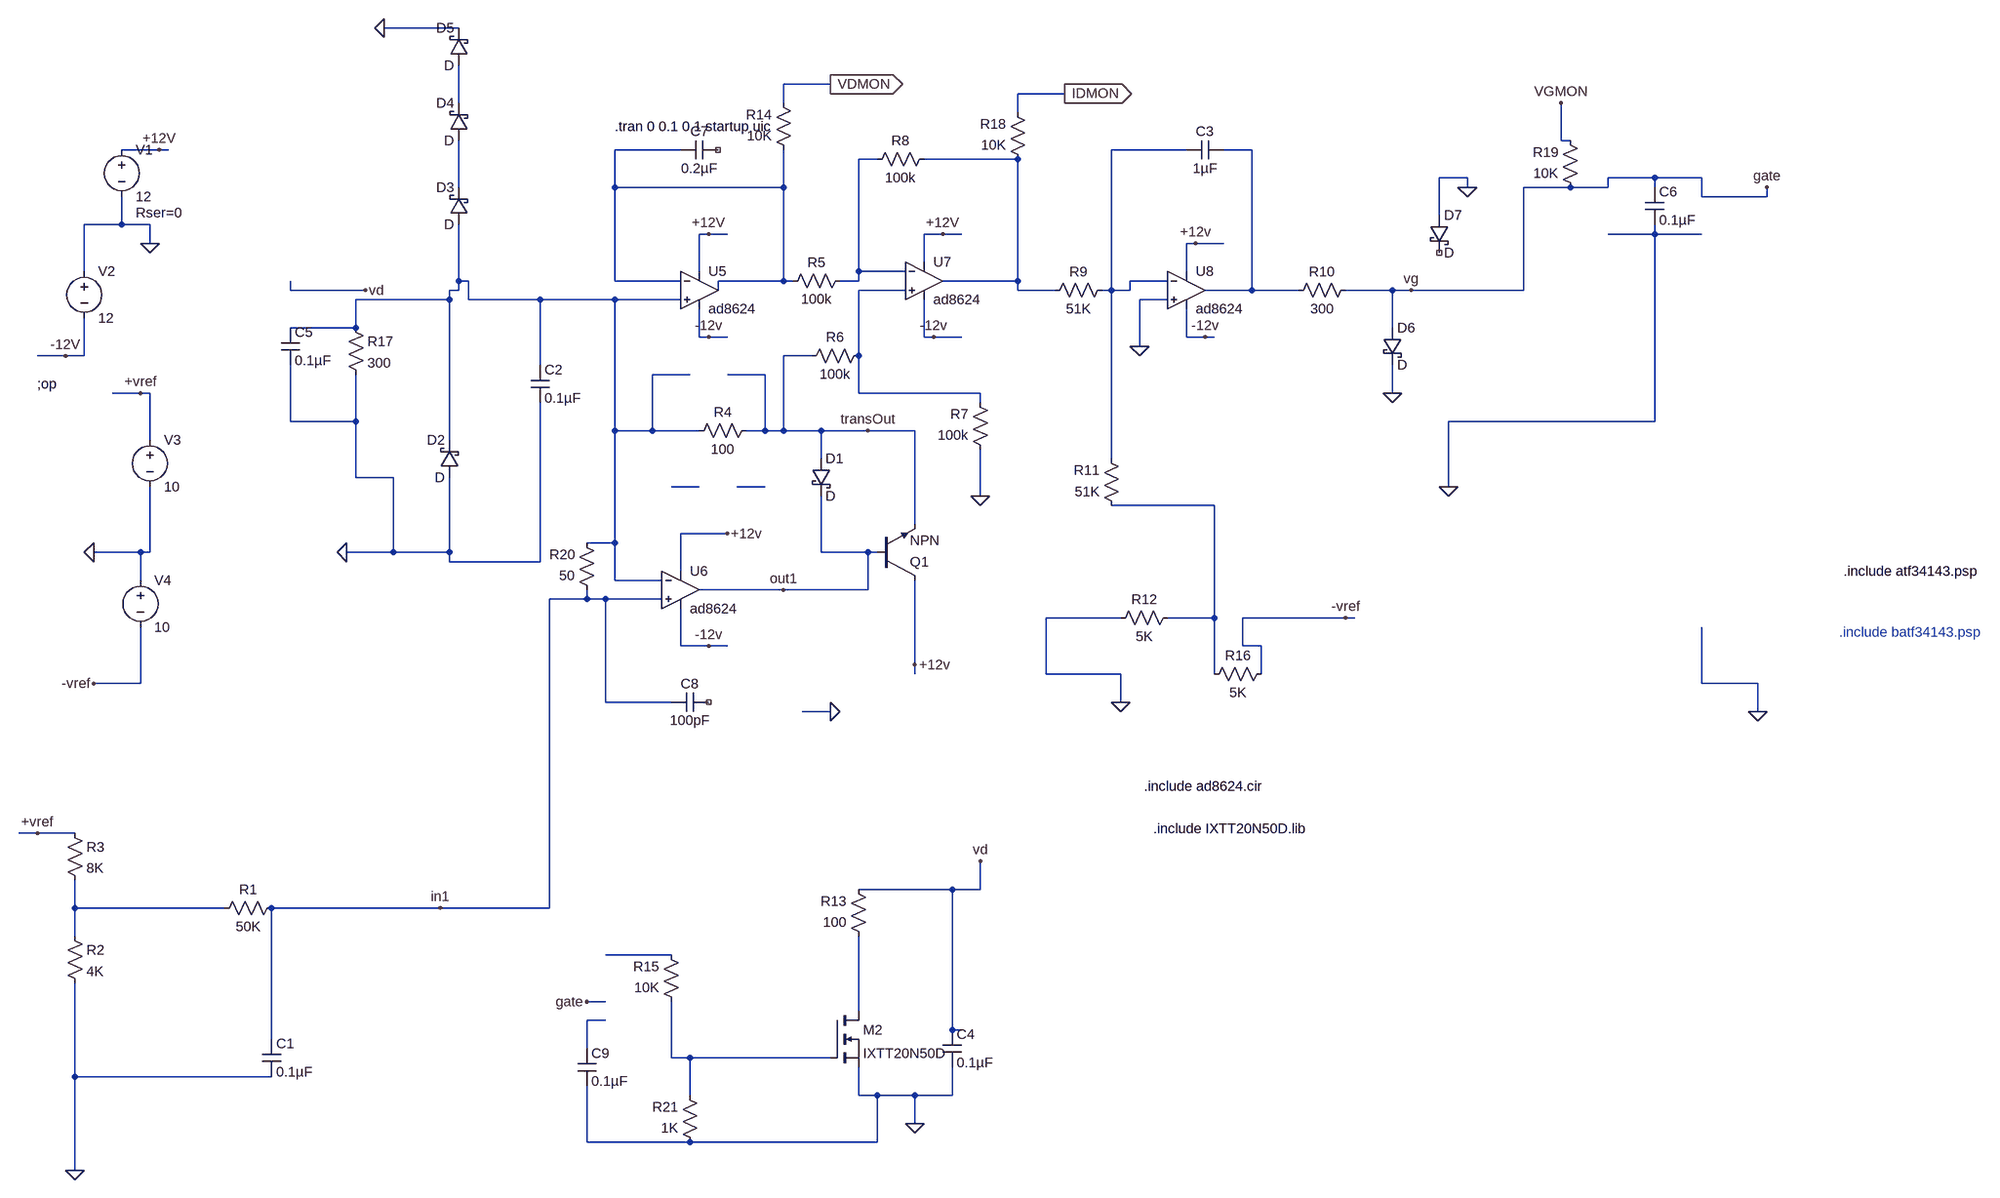
[diagram p0: schematic lnaPSUSpice.asc]
lnaPSUSpice.asc, the LTspice schematic file:
Version 4
SHEET 1 3948 1396
WIRE 160 -576 32 -576
WIRE 848 -480 768 -480
WIRE 1248 -464 1168 -464
WIRE 160 -448 160 -512
WIRE 768 -448 768 -480
WIRE 1168 -432 1168 -464
WIRE 2096 -384 2096 -448
WIRE 2112 -384 2096 -384
WIRE -352 -368 -416 -368
WIRE -336 -368 -352 -368
WIRE 592 -368 480 -368
WIRE 1456 -368 1328 -368
WIRE 1568 -368 1520 -368
WIRE 928 -352 896 -352
WIRE 1168 -352 1008 -352
WIRE 1936 -320 1888 -320
WIRE 2256 -320 2176 -320
WIRE 2336 -320 2256 -320
WIRE 160 -304 160 -384
WIRE 480 -304 480 -368
WIRE 768 -304 768 -368
WIRE 768 -304 480 -304
WIRE 1936 -304 1936 -320
WIRE 2112 -304 2032 -304
WIRE 2176 -304 2176 -320
WIRE 2176 -304 2112 -304
WIRE 2256 -304 2256 -320
WIRE 2336 -288 2336 -320
WIRE 2448 -288 2448 -304
WIRE 2448 -288 2336 -288
WIRE 1888 -256 1888 -320
WIRE -416 -240 -416 -288
WIRE -416 -240 -480 -240
WIRE -368 -240 -416 -240
WIRE 640 -224 624 -224
WIRE 672 -224 640 -224
WIRE 1040 -224 1008 -224
WIRE 1072 -224 1040 -224
WIRE 2256 -224 2256 -240
WIRE 2256 -224 2176 -224
WIRE 2336 -224 2256 -224
WIRE -368 -208 -368 -240
WIRE 1472 -208 1456 -208
WIRE 1520 -208 1472 -208
WIRE 1008 -176 1008 -224
WIRE -480 -160 -480 -240
WIRE 624 -160 624 -224
WIRE 896 -160 896 -352
WIRE 976 -160 896 -160
WIRE 1456 -160 1456 -208
WIRE 160 -144 160 -240
WIRE 176 -144 160 -144
WIRE 480 -144 480 -304
WIRE 592 -144 480 -144
WIRE 768 -144 768 -304
WIRE 768 -144 656 -144
WIRE 784 -144 768 -144
WIRE 896 -144 896 -160
WIRE 896 -144 864 -144
WIRE 1168 -144 1168 -352
WIRE 1168 -144 1040 -144
WIRE 1424 -144 1360 -144
WIRE -128 -128 -128 -144
WIRE 0 -128 -128 -128
WIRE 160 -128 160 -144
WIRE 160 -128 144 -128
WIRE 656 -128 656 -144
WIRE 976 -128 896 -128
WIRE 1168 -128 1168 -144
WIRE 1232 -128 1168 -128
WIRE 1328 -128 1328 -368
WIRE 1328 -128 1312 -128
WIRE 1360 -128 1360 -144
WIRE 1360 -128 1328 -128
WIRE 1568 -128 1568 -368
WIRE 1568 -128 1488 -128
WIRE 1648 -128 1568 -128
WIRE 1808 -128 1728 -128
WIRE 1840 -128 1808 -128
WIRE 2032 -128 2032 -304
WIRE 2032 -128 1840 -128
WIRE 144 -112 144 -128
WIRE 144 -112 -16 -112
WIRE 176 -112 176 -144
WIRE 352 -112 176 -112
WIRE 480 -112 352 -112
WIRE 592 -112 480 -112
WIRE 1424 -112 1376 -112
WIRE -16 -64 -16 -112
WIRE -16 -64 -128 -64
WIRE 1808 -64 1808 -128
WIRE 624 -48 624 -96
WIRE 640 -48 624 -48
WIRE 672 -48 640 -48
WIRE 1008 -48 1008 -112
WIRE 1024 -48 1008 -48
WIRE 1072 -48 1024 -48
WIRE 1456 -48 1456 -96
WIRE 1488 -48 1456 -48
WIRE 1504 -48 1488 -48
WIRE 1376 -32 1376 -112
WIRE -512 -16 -560 -16
WIRE -480 -16 -480 -80
WIRE -480 -16 -512 -16
WIRE 816 -16 768 -16
WIRE 896 -16 896 -128
WIRE 352 0 352 -112
WIRE 608 16 544 16
WIRE 736 16 672 16
WIRE -384 48 -432 48
WIRE -368 48 -384 48
WIRE 896 48 896 -16
WIRE 1104 48 896 48
WIRE 1808 48 1808 0
WIRE 1104 64 1104 48
WIRE -128 96 -128 0
WIRE -16 96 -16 16
WIRE -16 96 -128 96
WIRE 2256 96 2256 -224
WIRE 2256 96 1904 96
WIRE 480 112 480 -112
WIRE 544 112 544 16
WIRE 544 112 480 112
WIRE 624 112 544 112
WIRE 736 112 736 16
WIRE 736 112 704 112
WIRE 768 112 768 -16
WIRE 768 112 736 112
WIRE 832 112 768 112
WIRE 912 112 832 112
WIRE 992 112 912 112
WIRE -368 128 -368 48
WIRE 144 128 144 -112
WIRE 832 160 832 112
WIRE 1328 160 1328 -128
WIRE -16 192 -16 96
WIRE 48 192 -16 192
WIRE 624 208 576 208
WIRE 736 208 688 208
WIRE 1904 208 1904 96
WIRE 1104 224 1104 144
WIRE 1504 240 1328 240
WIRE 992 272 992 112
WIRE 672 288 592 288
WIRE 480 304 480 112
WIRE 480 304 432 304
WIRE -384 320 -464 320
WIRE -368 320 -368 208
WIRE -368 320 -384 320
WIRE 48 320 48 192
WIRE 48 320 -32 320
WIRE 144 320 144 192
WIRE 144 320 48 320
WIRE 832 320 832 224
WIRE 912 320 832 320
WIRE 928 320 912 320
WIRE 144 336 144 320
WIRE 352 336 352 64
WIRE 352 336 144 336
WIRE 592 352 592 288
WIRE -384 368 -384 320
WIRE 480 368 480 304
WIRE 560 368 480 368
WIRE 768 384 624 384
WIRE 912 384 912 320
WIRE 912 384 768 384
WIRE 432 400 432 384
WIRE 432 400 368 400
WIRE 464 400 432 400
WIRE 560 400 464 400
WIRE 1344 432 1216 432
WIRE 1504 432 1504 240
WIRE 1504 432 1424 432
WIRE 1728 432 1552 432
WIRE 1744 432 1728 432
WIRE 592 480 592 416
WIRE 640 480 592 480
WIRE 672 480 640 480
WIRE 1552 480 1552 432
WIRE 1584 480 1552 480
WIRE 992 512 992 368
WIRE 992 528 992 512
WIRE 1216 528 1216 432
WIRE 1344 528 1216 528
WIRE 1504 528 1504 432
WIRE 1584 528 1584 480
WIRE -384 544 -384 448
WIRE -384 544 -464 544
WIRE 2336 544 2336 448
WIRE 2432 544 2336 544
WIRE 464 576 464 400
WIRE 576 576 464 576
WIRE 1344 576 1344 528
WIRE 848 592 800 592
WIRE 2432 592 2432 544
WIRE -560 800 -592 800
WIRE -496 800 -560 800
WIRE 1056 896 896 896
WIRE 1104 896 1104 848
WIRE 1104 896 1056 896
WIRE -496 928 -496 880
WIRE -240 928 -496 928
WIRE 128 928 -160 928
WIRE 368 928 368 400
WIRE 368 928 128 928
WIRE -496 976 -496 928
WIRE 576 1008 464 1008
WIRE 464 1088 432 1088
WIRE 896 1104 896 976
WIRE 464 1120 432 1120
WIRE 1056 1136 1056 896
WIRE 1072 1136 1056 1136
WIRE -160 1152 -160 928
WIRE 432 1168 432 1120
WIRE 576 1184 576 1088
WIRE 608 1184 576 1184
WIRE 848 1184 608 1184
WIRE -496 1216 -496 1056
WIRE -160 1216 -496 1216
WIRE 608 1248 608 1184
WIRE 896 1248 896 1200
WIRE 928 1248 896 1248
WIRE 992 1248 928 1248
WIRE 1056 1248 1056 1200
WIRE 1056 1248 992 1248
WIRE 992 1296 992 1248
WIRE 432 1328 432 1232
WIRE 608 1328 432 1328
WIRE 928 1328 928 1248
WIRE 928 1328 608 1328
WIRE -496 1376 -496 1216
FLAG -368 -208 0
FLAG -352 -368 +12V
FLAG -512 -16 -12V
FLAG 640 -224 +12V
FLAG 1040 -224 +12V
FLAG 640 -48 -12v
FLAG 1024 -48 -12v
FLAG 1488 -48 -12v
FLAG 1472 -208 +12v
FLAG -384 48 +vref
FLAG -464 544 -vref
FLAG -464 320 0
FLAG -496 1376 0
FLAG 672 288 +12v
FLAG 640 480 -12v
FLAG 992 512 +12v
FLAG -560 800 +vref
FLAG -32 320 0
FLAG 1104 224 0
FLAG 1376 -32 0
FLAG 1728 432 -vref
FLAG 1840 -128 vg
FLAG 0 -128 vd
FLAG 1904 208 0
FLAG 128 928 in1
FLAG 768 384 out1
FLAG 32 -576 0
FLAG 1344 576 0
FLAG 1808 48 0
FLAG 1936 -304 0
FLAG 912 112 transOut
FLAG 848 -480 VDMON
IOPIN 848 -480 Out
FLAG 1248 -464 IDMON
IOPIN 1248 -464 Out
FLAG 2096 -448 VGMON
FLAG 2432 592 0
FLAG 992 1296 0
FLAG 2448 -304 gate
FLAG 432 1088 gate
FLAG 1104 848 vd
FLAG 848 592 0
SYMBOL voltage -416 -384 R0
WINDOW 123 0 0 Left 2
WINDOW 39 24 124 Left 2
SYMATTR SpiceLine Rser=0
SYMATTR InstName V1
SYMATTR Value 12
SYMBOL voltage -480 -176 R0
WINDOW 123 0 0 Left 2
WINDOW 39 0 0 Left 2
SYMATTR InstName V2
SYMATTR Value 12
SYMBOL res -144 912 R90
WINDOW 0 0 56 VBottom 2
WINDOW 3 32 56 VTop 2
SYMATTR InstName R1
SYMATTR Value 50K
SYMBOL res -512 960 R0
SYMATTR InstName R2
SYMATTR Value 4K
SYMBOL res -512 784 R0
SYMATTR InstName R3
SYMATTR Value 8K
SYMBOL voltage -368 112 R0
WINDOW 123 0 0 Left 2
WINDOW 39 0 0 Left 2
SYMATTR InstName V3
SYMATTR Value 10
SYMBOL voltage -384 352 R0
WINDOW 123 0 0 Left 2
WINDOW 39 0 0 Left 2
SYMATTR InstName V4
SYMATTR Value 10
SYMBOL cap -176 1152 R0
SYMATTR InstName C1
SYMATTR Value 0.1µF
SYMBOL res 720 96 R90
WINDOW 0 0 56 VBottom 2
WINDOW 3 32 56 VTop 2
SYMATTR InstName R4
SYMATTR Value 100
SYMBOL npn 928 368 M180
SYMATTR InstName Q1
SYMBOL schottky 816 160 R0
SYMATTR InstName D1
SYMBOL schottky 160 192 R180
WINDOW 0 24 64 Left 2
WINDOW 3 24 0 Left 2
SYMATTR InstName D2
SYMBOL cap 336 0 R0
SYMATTR InstName C2
SYMATTR Value 0.1µF
SYMBOL res 880 -160 R90
WINDOW 0 0 56 VBottom 2
WINDOW 3 32 56 VTop 2
SYMATTR InstName R5
SYMATTR Value 100k
SYMBOL res 912 -32 R90
WINDOW 0 0 56 VBottom 2
WINDOW 3 32 56 VTop 2
SYMATTR InstName R6
SYMATTR Value 100k
SYMBOL res 1120 160 R180
WINDOW 0 36 76 Left 2
WINDOW 3 36 40 Left 2
SYMATTR InstName R7
SYMATTR Value 100k
SYMBOL res 1024 -368 R90
WINDOW 0 0 56 VBottom 2
WINDOW 3 32 56 VTop 2
SYMATTR InstName R8
SYMATTR Value 100k
SYMBOL res 1328 -144 R90
WINDOW 0 0 56 VBottom 2
WINDOW 3 32 56 VTop 2
SYMATTR InstName R9
SYMATTR Value 51K
SYMBOL cap 1520 -384 R90
WINDOW 0 0 32 VBottom 2
WINDOW 3 32 32 VTop 2
SYMATTR InstName C3
SYMATTR Value 1µF
SYMBOL res 1744 -144 R90
WINDOW 0 0 56 VBottom 2
WINDOW 3 32 56 VTop 2
SYMATTR InstName R10
SYMATTR Value 300
SYMBOL res 1344 256 R180
WINDOW 0 36 76 Left 2
WINDOW 3 36 40 Left 2
SYMATTR InstName R11
SYMATTR Value 51K
SYMBOL res 1328 448 R270
WINDOW 0 32 56 VTop 2
WINDOW 3 0 56 VBottom 2
SYMATTR InstName R12
SYMATTR Value 5K
SYMBOL schottky 176 -240 R180
WINDOW 0 24 64 Left 2
WINDOW 3 24 0 Left 2
SYMATTR InstName D3
SYMBOL schottky 176 -384 R180
WINDOW 0 24 64 Left 2
WINDOW 3 24 0 Left 2
SYMATTR InstName D4
SYMBOL schottky 176 -512 R180
WINDOW 0 24 64 Left 2
WINDOW 3 24 0 Left 2
SYMATTR InstName D5
SYMBOL schottky 1792 -64 R0
SYMATTR InstName D6
SYMBOL schottky 1872 -256 R0
SYMATTR InstName D7
SYMBOL res 1600 512 R90
WINDOW 0 0 56 VBottom 2
WINDOW 3 32 56 VTop 2
SYMATTR InstName R16
SYMATTR Value 5K
SYMBOL Opamps\\opamp2 624 -192 R0
SYMATTR InstName U5
SYMATTR Value ad8624
SYMBOL Opamps\\opamp2 592 320 R0
SYMATTR InstName U6
SYMATTR Value ad8624
SYMBOL Opamps\\opamp2 1008 -208 R0
SYMATTR InstName U7
SYMATTR Value ad8624
SYMBOL Opamps\\opamp2 1456 -192 R0
SYMATTR InstName U8
SYMATTR Value ad8624
SYMBOL res -32 -80 R0
SYMATTR InstName R17
SYMATTR Value 300
SYMBOL cap -144 -64 R0
SYMATTR InstName C5
SYMATTR Value 0.1µF
SYMBOL cap 656 -384 R90
WINDOW 0 0 32 VBottom 2
WINDOW 3 32 32 VTop 2
SYMATTR InstName C7
SYMATTR Value 0.2µF
SYMBOL res 784 -352 R180
WINDOW 0 36 76 Left 2
WINDOW 3 36 40 Left 2
SYMATTR InstName R14
SYMATTR Value 10K
SYMBOL res 1184 -336 R180
WINDOW 0 36 76 Left 2
WINDOW 3 36 40 Left 2
SYMATTR InstName R18
SYMATTR Value 10K
SYMBOL res 2128 -288 R180
WINDOW 0 36 76 Left 2
WINDOW 3 36 40 Left 2
SYMATTR InstName R19
SYMATTR Value 10K
SYMBOL cap 2240 -304 R0
SYMATTR InstName C6
SYMATTR Value 0.1µF
SYMBOL cap 640 560 R90
WINDOW 0 0 32 VBottom 2
WINDOW 3 32 32 VTop 2
SYMATTR InstName C8
SYMATTR Value 100pF
SYMBOL nmos 848 1104 R0
SYMATTR InstName M2
SYMATTR Value IXTT20N50D
SYMBOL cap 1040 1136 R0
SYMATTR InstName C4
SYMATTR Value 0.1µF
SYMBOL res 912 992 R180
WINDOW 0 36 76 Left 2
WINDOW 3 36 40 Left 2
SYMATTR InstName R13
SYMATTR Value 100
SYMBOL res 448 400 R180
WINDOW 0 36 76 Left 2
WINDOW 3 36 40 Left 2
SYMATTR InstName R20
SYMATTR Value 50
SYMBOL res 592 1104 R180
WINDOW 0 36 76 Left 2
WINDOW 3 36 40 Left 2
SYMATTR InstName R15
SYMATTR Value 10K
SYMBOL res 624 1344 R180
WINDOW 0 36 76 Left 2
WINDOW 3 36 40 Left 2
SYMATTR InstName R21
SYMATTR Value 1K
SYMBOL cap 416 1168 R0
SYMATTR InstName C9
SYMATTR Value 0.1µF
TEXT -560 32 Left 2 !;op
TEXT 480 -408 Left 2 !.tran 0 0.1 0 1 startup uic
TEXT 1384 720 Left 2 !.include ad8624.cir
TEXT 2864 352 Left 2 !.include atf34143.psp
TEXT 2856 456 Left 2 ;.include batf34143.psp
TEXT 1400 792 Left 2 !.include IXTT20N50D.lib

The netlist it stands for:
* lnaPSUSpice.asc
V1 +12V 0 12 Rser=0
V2 0 -12V 12
R1 in1 N013 50K
R2 N013 0 4K
R3 +vref N013 8K
V3 +vref 0 10
V4 0 -vref 10
C1 in1 0 0.1µF
R4 transOut N008 100
Q1 +12V out1 transOut 0 NPN
D1 transOut out1 D
D2 0 N008 D
C2 N008 0 0.1µF
R5 N005 N002 100k
R6 N009 transOut 100k
R7 0 N009 100k
R8 N006 N005 100k
R9 N003 N006 51K
C3 N004 N003 1µF
R10 gate N004 300
R11 N012 N003 51K
R12 0 N012 5K
D3 N008 N007 D
D4 N007 N001 D
D5 N001 0 D
D6 gate 0 D
D7 0 NC_01 D
R16 -vref N012 5K
XU5 N008 N002 +12V -12V N002 ad8624  ; pins In+ In- V+ V- OUT
XU6 in1 N008 +12V -12V out1 ad8624  ; pins In+ In- V+ V- OUT
XU7 N009 N005 +12V -12V N006 ad8624  ; pins In+ In- V+ V- OUT
XU8 0 N003 +12V -12V N004 ad8624  ; pins In+ In- V+ V- OUT
R17 N008 0 300
C5 N008 0 0.1µF
C7 NC_02 N002 0.2µF
R14 N002 VDMON 10K
R18 N006 IDMON 10K
R19 gate VGMON 10K
C6 gate 0 0.1µF
C8 NC_03 in1 100pF
M2 N015 N017 0 0 IXTT20N50D
C4 vd 0 0.1µF
R13 N015 vd 100
R20 in1 N008 50
R15 N017 N014 10K
R21 0 N017 1K
C9 N016 0 0.1µF
.model D D
.lib standard.dio
.model NPN NPN
.model PNP PNP
.lib standard.bjt
.model NMOS NMOS
.model PMOS PMOS
.lib standard.mos
;op
.tran 0 0.1 0 1 startup uic
.include ad8624.cir
.include atf34143.psp
* .include batf34143.psp
.include IXTT20N50D.lib
.backanno
.end